# EAGLE board ad060 (EAGLE 5.11), part 1 of 2
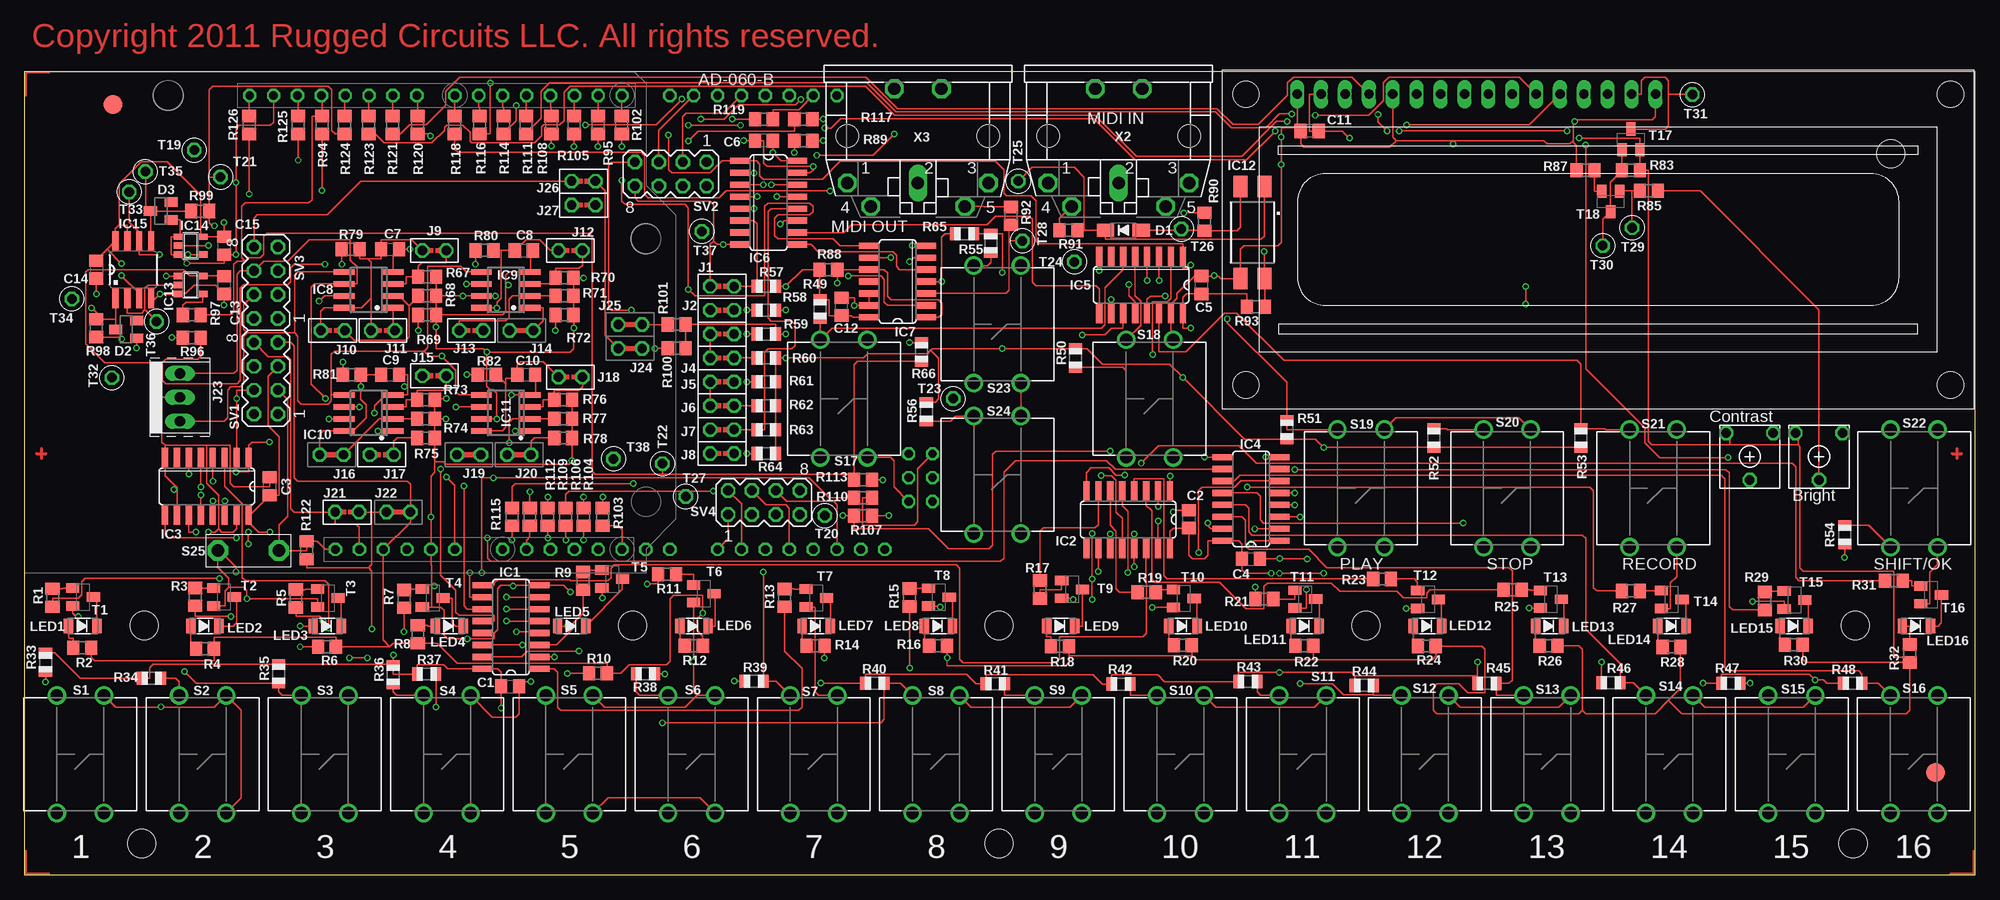
[diagram p9: board, top side]
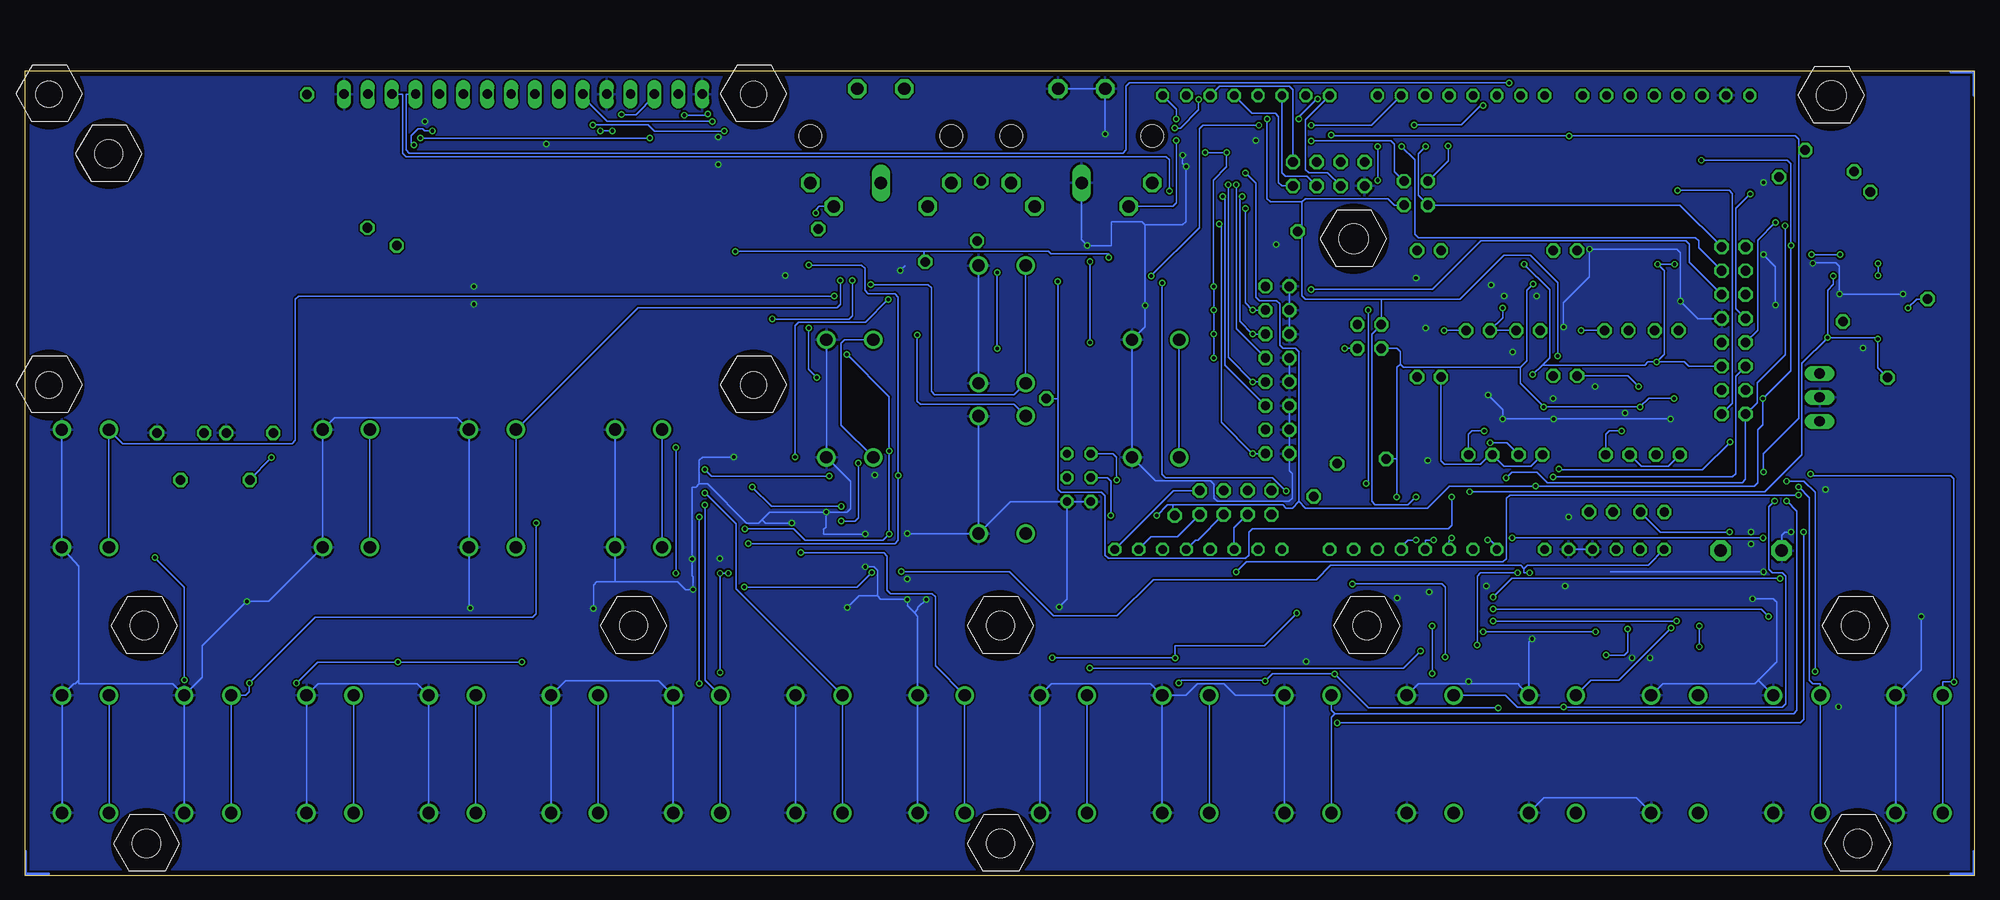
[diagram p10: board, bottom side, seen from below]

Size 207.39 x 85.47 mm. Coordinates in mm from the lower left corner, seen from the top.
Outline: 0,85.47 207.39,85.47 207.39,0 0,0 0,85.47
Copper layers (1*16): Top 0.137mm / dielectric 1.313mm / Bottom 0.137mm
Design rules "wusik *": minimum track width 7mil, minimum drill 15mil, track to track 7mil, track to pad 7mil, pad to pad 7mil, via to via 7mil, smd to smd 0mil, copper to edge 20mil, drill to drill 8mil, minimum pad ring 10mil, minimum via ring 6mil, stop-mask expansion 2mil, vias tented up to drill 0mil, thermal gap 10mil
Net classes: 0 default: width 0.178 mm, drill 0.381 mm, clearance 0.178 mm
Holes 3.17 mm at 15.27,82.91 66.07,67.67
bKeepout: area 62.8,56.7 to 67,63.4
tRestrict: area 43.1,66.2 to 44.1,66.7; area 58.9,73.5 to 59.9,74; area 58.9,71 to 60.1,71.5; area 57.5,66.2 to 58.5,66.7; area 46.9,57.7 to 48.1,58; area 32.1,57.7 to 33.4,58.2; area 37.6,57.8 to 38.6,58; area 43.1,52.8 to 44.2,53.3; area 37.5,44.5 to 38.6,45; area 32,44.6 to 33.1,45; area 52.2,57.8 to 53.3,58.2; area 57.5,52.7 to 58.7,53.1; 13 more areas

## Footprints (pad centres in the part's own frame; a part is rotated, then mirrored left to right if it is on the bottom)
C0805 = smd 1.3 x 1.5: 1 -0.95,0; 2 0.95,0
SOD-123 = smd 1.83 x 1.4: A 1.9,0; K -1.9,0
SOT-23 = smd 1 x 1.4: 1 -0.95,-1.1; 2 0.95,-1.1; 3 0,1.1
FIDUCIAL_2MMCIRCLE = smd 2 x 2: P$1 0,0
SO16 = smd 0.66 x 2.032: 1 -4.445,-3.073; 2 -3.175,-3.073; 3 -1.905,-3.073; 4 -0.635,-3.073; 5 0.635,-3.073; 6 1.905,-3.073; 7 3.175,-3.073; 8 4.445,-3.073; 9 4.445,3.073; 10 3.175,3.073; 11 1.905,3.073; 12 0.635,3.073; 13 -0.635,3.073; 14 -1.905,3.073; 15 -3.175,3.073; 16 -4.445,3.073
SO14 = smd 0.66 x 2.032: 1 -3.81,-3.073; 2 -2.54,-3.073; 3 -1.27,-3.073; 4 0,-3.073; 5 1.27,-3.073; 6 2.54,-3.073; 7 3.81,-3.073; 8 3.81,3.073; 9 2.54,3.073; 10 1.27,3.073; 11 0,3.073; 12 -1.27,3.073; 13 -2.54,3.073; 14 -3.81,3.073
SO-08 = smd 0.6 x 2.2: 1 -1.905,-2.6; 2 -0.635,-2.6; 3 0.635,-2.6; 4 1.905,-2.6; 5 1.905,2.6; 6 0.635,2.6; 7 -0.635,2.6; 8 -1.905,2.6
LITEON.SMD4 = smd 2.3 x 1.5: 1 -4.9,1.27; 2 -4.9,-1.27; 3 4.9,-1.27; 4 4.9,1.27
SOT23-5 = smd 0.69 x 0.99: 1 -0.95,-1.29; 2 0,-1.29; 3 0.95,-1.29; 4 0.95,1.3; 5 -0.95,1.3
SO08 = smd 0.66 x 2.032: 1 -1.905,-3.073; 2 -0.635,-3.073; 3 0.635,-3.073; 4 1.905,-3.073; 5 1.905,3.073; 6 0.635,3.073; 7 -0.635,3.073; 8 -1.905,3.073
JP2NO = drill 1 octagon: 1 -1.27,0; 2 1.27,0
JP2NC = drill 1 octagon: 1 -1.27,0; 2 1.27,0
GC22232031 = drill 1.067 long: 1 0,0; 2 2.54,0; 3 5.08,0
LED1206 = smd 1 x 1.5: A -1.5,0; K 1.5,0
SHIELD-NOTEXT-OCTAGONALPAD = drill 0.9 pad 1.27 octagon: 0_RX -25.4,27.94; 1_TX -25.4,25.4; 2 -25.4,22.86; 3 -25.4,20.32; 3V3 22.86,0; 4 -25.4,17.78; 5 -25.4,15.24; 5V 22.86,2.54; 6 -25.4,12.7; 7 -25.4,10.16; 8 -25.4,6.121; 9 -25.4,3.581; 10 -25.4,1.041; 11 -25.4,-1.499; 12 -25.4,-4.039; 13 -25.4,-6.579; A_0 22.86,15.24; A_1 22.86,17.78; A_2 22.86,20.32; A_3 22.86,22.86; A_4 22.86,25.4; A_5 22.86,27.94; AREF -25.4,-11.659; GND0 -25.4,-9.119; GND1 22.86,7.62; GND2 22.86,5.08; RESET 22.86,-2.54; VIN 22.86,10.16
MEGA-EXTRAPINS-SPIONLY = drill 0.9 octagon: 14 5.08,0; 15 7.62,0; 16 10.16,0; 17 12.7,0; 18 15.24,0; 19 17.78,0; 20 20.32,0; 21 22.86,0; 50 30.48,-38.1; 51 33.02,-38.1; 52 30.48,-40.64; 53 33.02,-40.64; A6 2.54,-48.26; A7 5.08,-48.26; A8 10.16,-48.26; A9 12.7,-48.26; A10 15.24,-48.26; A11 17.78,-48.26; A12 20.32,-48.26; A13 22.86,-48.26; A14 25.4,-48.26; A15 27.94,-48.26; GND@1 30.48,-43.18; GND@2 33.02,-43.18
R0805 = smd 1.3 x 1.5: 1 -0.95,0; 2 0.95,0
R0805' = smd 1.1 x 1.4: 1 -1,0; 2 1,0
EVND8A = drill 1 octagon: 1 -2.5,-2.5; 2 0,2.5; 3 2.5,-2.5
TL1100F160Q = drill 1.3 round: 1 -6.25,-2.5; 2 6.25,-2.5; 3 -6.25,2.5; 4 6.25,2.5
EVQPJ = drill 1.3 pad 2.184 octagon: A 0,0; B 6.5,0
MA04-2 = drill 1.016 octagon: 1 -3.81,-1.27; 2 -3.81,1.27; 3 -1.27,-1.27; 4 -1.27,1.27; 5 1.27,-1.27; 6 1.27,1.27; 7 3.81,-1.27; 8 3.81,1.27
SOT23-BEC = smd 1 x 1.4: B -0.95,-1.1; C 0,1.1; E 0.95,-1.1
TP40MIL = drill 1.016 octagon: 1 0,0
4-40SCREWHEXNUT = hole 2.997: 0,0
LCD1602 = drill 1 long: 1 8,33.46; 2 10.54,33.46; 3 13.08,33.46; 4 15.62,33.46; 5 18.16,33.46; 6 20.7,33.46; 7 23.24,33.46; 8 25.78,33.46; 9 28.32,33.46; 10 30.86,33.46; 11 33.4,33.46; 12 35.94,33.46; 13 38.48,33.46; 14 41.02,33.46; 15 43.56,33.46; 16 46.1,33.46 | hole 2.8: 2.54,2.54; 2.54,33.46; 77.46,33.46; 77.46,2.54
SDS-50J = drill 1.321 octagon: 1 7.5,5; 3 -7.5,5; 4 5,7.5; 5 -5,7.5; PE -2.5,-5; PE@ 2.5,-5 | drill 1.321 long: 2 0,5 | hole 2.4: 7.5,0; -7.5,0

## Placement (x,y rotation side)
C1  0.1uF  [C0805]  51.62,20.08 0 top
C2  0.1uF  [C0805]  123.83,37.86 90 top
C3  0.1uF  [C0805]  26.06,41.36 90 top
C4  0.1uF  [C0805]  130.41,33.63 0 top
C5  0.1uF  [C0805]  125.16,62.75 90 top
C6  0.1uF  [C0805]  78.61,78.11 180 top
C7  0.1uF  [C0805]  38.86,66.55 0 top
C8  0.1uF  [C0805]  53.09,66.42 0 top
C9  0.1uF  [C0805]  38.86,53.21 0 top
C10  0.1uF  [C0805]  53.34,53.21 0 top
C11  0.1uF  [C0805]  136.65,79.12 180 top
C12  0.1uF  [C0805]  86.87,60.45 90 top
C13  0.1uF  [C0805]  21.21,62.74 270 top
C14  0.1uF  [C0805]  7.62,64.39 270 top
C15  0.1uF  [C0805]  21.21,66.93 270 top
D1  [SOD-123]  116.84,68.58 0 top
D2  3.3V  [SOT-23]  10.79,58.04 90 top
D3  3.3V  [SOT-23]  14.48,70.61 90 top
FM1  FIDUCIAL2MMCIRCLE  [FIDUCIAL_2MMCIRCLE]  203.2,10.92 0 top
FM2  FIDUCIAL2MMCIRCLE  [FIDUCIAL_2MMCIRCLE]  9.4,81.92 0 top
FM3  [CROSSHAIR_12MIL]  1.78,44.83 0 top
FM4  [CROSSHAIR_12MIL]  205.49,44.83 0 top
IC1  74HC595D  [SO16]  51.71,26.38 90 top
IC2  74HC595D  [SO16]  117.36,37.81 180 top
IC3  74HC165D  [SO16]  19.37,41.34 180 top
IC4  74HC165D  [SO16]  130.43,40.01 90 top
IC5  74HC165D  [SO16]  118.73,62.75 180 top
IC6  74HC165D  [SO16]  79.1,71.5 270 top
IC7  74HC125D  [SO14]  92.84,63.12 90 top
IC8  M24256-BWMN6P  [SO-08]  36.58,62.23 90 top
IC9  M24256-BWMN6P  [SO-08]  51.18,62.23 90 top
IC10  M24256-BWMN6P  [SO-08]  36.58,49.15 90 top
IC11  M24256-BWMN6P  [SO-08]  51.18,49.15 90 top
IC12  LTV-817S  [LITEON.SMD4]  130.56,68.33 270 top
IC13  74VHC1GT125D  [SOT23-5]  17.65,62.74 270 top
IC14  74VHC1GT125D  [SOT23-5]  17.65,66.93 270 top
IC15  SST25VF040B  [SO08]  11.56,64.39 0 top
J1  JP2NO  [JP2NO]  74.17,62.61 0 top
J2  JP2NO  [JP2NO]  74.17,60.07 0 top
J3  JP2NO  [JP2NO]  74.17,57.53 0 top
J4  JP2NO  [JP2NO]  74.17,54.99 0 top
J5  JP2NO  [JP2NO]  74.17,52.45 0 top
J6  JP2NO  [JP2NO]  74.17,49.91 0 top
J7  JP2NO  [JP2NO]  74.17,47.37 0 top
J8  JP2NO  [JP2NO]  74.17,44.83 0 top
J9  JP2NO  [JP2NO]  43.56,66.42 180 top
J10  JP2NO  [JP2NO]  32.77,57.91 180 top
J11  JP2NO  [JP2NO]  38.1,57.91 180 top
J12  JP2NO  [JP2NO]  58.04,66.42 180 top
J13  JP2NO  [JP2NO]  47.5,57.91 0 top
J14  JP2NC  [JP2NC]  52.83,57.91 180 top
J15  JP2NO  [JP2NO]  43.56,53.09 180 top
J16  JP2NC  [JP2NC]  32.64,44.7 180 top
J17  JP2NO  [JP2NO]  37.97,44.7 180 top
J18  JP2NO  [JP2NO]  58.04,52.96 180 top
J19  JP2NC  [JP2NC]  47.24,44.7 180 top
J20  JP2NC  [JP2NC]  52.58,44.7 180 top
J21  JP2NO  [JP2NO]  34.29,38.61 0 top
J22  JP2NC  [JP2NC]  39.75,38.61 0 top
J23  CON3P1R.GC22232031  [GC22232031]  16.51,48.26 90 top
J24  JP2NC  [JP2NC]  64.39,56.01 0 top
J25  JP2NC  [JP2NC]  64.39,58.55 0 top
J26  JP2NO  [JP2NO]  59.44,73.79 0 top
J27  JP2NO  [JP2NO]  59.44,71.25 0 top
LED1  Red  [LED1206]  6.17,26.49 0 top
LED2  Red  [LED1206]  19.17,26.49 0 top
LED3  Red  [LED1206]  32.17,26.49 0 top
LED4  Red  [LED1206]  45.17,26.49 0 top
LED5  Red  [LED1206]  58.17,26.49 0 top
LED6  Red  [LED1206]  71.17,26.49 0 top
LED7  Red  [LED1206]  84.17,26.49 0 top
LED8  Red  [LED1206]  97.17,26.49 0 top
LED9  Red  [LED1206]  110.17,26.49 0 top
LED10  Red  [LED1206]  123.17,26.49 0 top
LED11  Red  [LED1206]  136.17,26.49 0 top
LED12  Red  [LED1206]  149.17,26.49 0 top
LED13  Red  [LED1206]  162.17,26.49 0 top
LED14  Red  [LED1206]  175.17,26.49 0 top
LED15  Red  [LED1206]  188.17,26.49 0 top
LED16  Red  [LED1206]  201.17,26.49 0 top
M1  Arduino UNO  [SHIELD-NOTEXT-OCTAGONALPAD]  35.59,57.51 270 top
M2  [MEGA-EXTRAPINS-SPIONLY]  63.53,82.91 0 top
R1  10k  [R0805]  2.96,29.49 270 top
R2  300  [R0805]  6.12,24.18 0 top
R3  10k  [R0805]  18.15,29.59 270 top
R4  300  [R0805]  19.19,24.09 0 top
R5  10k  [R0805]  28.85,29.42 270 top
R6  300  [R0805]  32.16,24.29 0 top
R7  10k  [R0805]  40.34,29.38 270 top
R8  300  [R0805]  41.81,25.62 270 top
R9  10k  [R0805]  59.39,31.29 270 top
R10  300  [R0805]  60.96,21.46 0 top
R11  10k  [R0805]  68.31,31.99 180 top
R12  300  [R0805]  71.16,24.4 0 top
R13  10k  [R0805]  80.81,29.48 270 top
R14  300  [R0805]  84.1,24.37 0 top
R15  10k  [R0805]  94.12,29.53 270 top
R16  300  [R0805]  97.14,24.4 0 top
R17  10k  [R0805]  107.97,30.38 90 top
R18  300  [R0805]  110.1,24.36 0 top
R19  10k  [R0805]  119.33,30.09 180 top
R20  300  [R0805]  123.16,24.44 0 top
R21  10k  [R0805]  131.83,29.36 180 top
R22  300  [R0805]  136.09,24.41 0 top
R23  10k  [R0805]  144.35,31.49 180 top
R24  300  [R0805]  149.11,24.36 0 top
R25  10k  [R0805]  158.24,30.34 180 top
R26  300  [R0805]  162.05,24.39 0 top
R27  10k  [R0805]  170.81,30.22 180 top
R28  300  [R0805]  175.14,24.26 0 top
R29  10k  [R0805]  185.04,29.15 270 top
R30  300  [R0805]  188.13,24.49 0 top
R31  10k  [R0805]  198.79,31.31 180 top
R32  300  [R0805]  200.47,23.57 270 top
R33  10k  [R0805']  2.22,22.62 90 top
R34  10k  [R0805']  13.49,20.92 180 top
R35  10k  [R0805']  27,21.42 90 top
R36  10k  [R0805']  39.2,21.32 90 top
R37  10k  [R0805']  42.74,21.39 180 top
R38  10k  [R0805']  66.02,21.4 0 top
R39  10k  [R0805']  77.56,20.64 180 top
R40  10k  [R0805']  90.41,20.42 180 top
R41  10k  [R0805']  103.22,20.36 180 top
R42  10k  [R0805']  116.58,20.32 180 top
R43  10k  [R0805']  130.09,20.59 180 top
R44  10k  [R0805']  142.46,20.17 180 top
R45  10k  [R0805']  155.5,20.39 180 top
R46  10k  [R0805']  168.69,20.47 180 top
R47  10k  [R0805']  181.44,20.41 180 top
R48  10k  [R0805']  194.39,20.41 180 top
R49  10k  [R0805']  84.58,60.2 90 top
R50  10k  [R0805']  111.76,54.99 90 top
R51  10k  [R0805']  134.24,47.37 270 top
R52  10k  [R0805']  149.86,46.48 270 top
R53  10k  [R0805']  165.48,46.48 270 top
R54  10k  [R0805']  193.55,36.2 270 top
R55  10k  [R0805']  102.74,67.18 90 top
R56  10k  [R0805']  95.89,49.28 90 top
R57  10k  [R0805']  78.87,62.61 0 top
R58  10k  [R0805']  78.87,60.07 0 top
R59  10k  [R0805']  78.87,57.53 0 top
R60  10k  [R0805']  78.87,54.99 0 top
R61  10k  [R0805']  78.87,52.45 0 top
R62  10k  [R0805']  78.87,49.91 0 top
R63  10k  [R0805']  78.87,47.37 0 top
R64  10k  [R0805']  78.87,44.83 0 top
R65  10k  [R0805']  99.95,68.2 0 top
R66  1k  [R0805']  95.38,55.63 90 top
R67  10k  [R0805]  42.8,63.63 180 top
R68  10k  [R0805]  42.8,61.59 180 top
R69  10k  [R0805]  42.8,59.56 180 top
R70  10k  [R0805]  57.4,63.5 180 top
R71  10k  [R0805]  57.4,61.59 180 top
R72  10k  [R0805]  57.4,59.56 180 top
R73  10k  [R0805]  42.67,50.55 180 top
R74  10k  [R0805]  42.67,48.51 180 top
R75  10k  [R0805]  42.67,46.48 180 top
R76  10k  [R0805]  57.28,50.55 180 top
R77  10k  [R0805]  57.28,48.51 180 top
R78  10k  [R0805]  57.28,46.48 180 top
R79  10  [R0805]  34.67,66.55 0 top
R80  10  [R0805]  48.9,66.42 0 top
R81  10  [R0805]  34.8,53.21 0 top
R82  10  [R0805]  49.15,53.21 0 top
R83  10k  [R0805]  170.81,74.93 0 top
R84  10k  [EVND8A]  183.45,44.51 180 top
R85  10k  [R0805]  172.72,72.77 180 top
R86  10k  [EVND8A]  190.82,44.51 180 top
R87  4.7k  [R0805]  165.99,74.93 0 top
R88  10k  [R0805]  85.47,64.39 180 top
R89  120  [R0805]  82.8,78.11 180 top
R90  120  [R0805]  125.48,69.47 90 top
R91  120  [R0805]  111,68.58 0 top
R92  120  [R0805]  104.9,70.1 90 top
R93  300  [R0805]  130.94,60.45 180 top
R94  1k  [R0805]  31.62,79.76 90 top
R95  1k  [R0805]  60.96,79.76 90 top
R96  10k  [R0805]  17.78,57.15 0 top
R97  1k  [R0805]  17.78,59.56 180 top
R98  1k  [R0805]  7.62,58.17 90 top
R99  1k  [R0805]  18.67,70.61 180 top
R100  1.5k  [R0805]  69.34,56.01 0 top
R101  1.5k  [R0805]  69.34,58.55 0 top
R102  100  [R0805]  63.5,79.76 90 top
R103  100  [R0805]  61.47,38.1 90 top
R104  100  [R0805]  59.44,38.1 90 top
R105  100  [R0805]  58.42,79.76 90 top
R106  100  [R0805]  57.53,38.1 90 top
R107  100  [R0805]  89.15,38.23 0 top
R108  100  [R0805]  56.01,79.76 90 top
R109  100  [R0805]  55.63,38.1 90 top
R110  100  [R0805]  89.15,40.13 0 top
R111  100  [R0805]  53.34,79.76 90 top
R112  100  [R0805]  53.72,38.1 90 top
R113  100  [R0805]  89.15,42.04 0 top
R114  100  [R0805]  50.93,79.76 90 top
R115  100  [R0805]  51.82,38.1 90 top
R116  100  [R0805]  48.39,79.76 90 top
R117  100  [R0805]  82.8,80.39 0 top
R118  100  [R0805]  45.72,79.76 90 top
R119  100  [R0805]  78.61,80.39 0 top
R120  100  [R0805]  41.78,79.76 90 top
R121  100  [R0805]  39.12,79.76 90 top
R122  10k  [R0805]  29.97,34.54 270 top
R123  100  [R0805]  36.58,79.76 90 top
R124  100  [R0805]  34.04,79.76 90 top
R125  100  [R0805]  29.08,79.76 90 top
R126  100  [R0805]  23.88,79.76 90 top
S1  [TL1100F160Q]  5.92,12.87 90 top
S2  [TL1100F160Q]  18.92,12.87 90 top
S3  [TL1100F160Q]  31.92,12.87 90 top
S4  [TL1100F160Q]  44.92,12.87 90 top
S5  [TL1100F160Q]  57.92,12.87 90 top
S6  [TL1100F160Q]  70.92,12.87 90 top
S7  [TL1100F160Q]  83.92,12.87 90 top
S8  [TL1100F160Q]  96.92,12.87 90 top
S9  [TL1100F160Q]  109.92,12.87 90 top
S10  [TL1100F160Q]  122.92,12.87 90 top
S11  [TL1100F160Q]  135.92,12.87 90 top
S12  [TL1100F160Q]  148.92,12.87 90 top
S13  [TL1100F160Q]  161.92,12.87 90 top
S14  [TL1100F160Q]  174.92,12.87 90 top
S15  [TL1100F160Q]  187.92,12.87 90 top
S16  [TL1100F160Q]  200.92,12.87 90 top
S17  [TL1100F160Q]  87.12,50.67 90 top
S18  [TL1100F160Q]  119.63,50.67 90 top
S19  [TL1100F160Q]  142.11,41.12 90 top
S20  [TL1100F160Q]  157.65,41.12 90 top
S21  [TL1100F160Q]  173.19,41.12 90 top
S22  [TL1100F160Q]  200.94,41.12 90 top
S23  [TL1100F160Q]  103.44,58.57 90 top
S24  [TL1100F160Q]  103.44,42.57 90 top
S25  [EVQPJ]  20.55,34.51 0 top
SV1  [MA04-2]  25.65,52.83 90 top
SV2  [MA04-2]  68.71,74.55 180 top
SV3  [MA04-2]  25.65,62.99 90 top
SV4  [MA04-2]  78.61,39.62 0 top
T1  NPN  [SOT23-BEC]  6.21,29.56 270 top
T2  NPN  [SOT23-BEC]  21.2,29.58 270 top
T3  NPN  [SOT23-BEC]  32.25,29.46 270 top
T4  NPN  [SOT23-BEC]  43.4,29.46 270 top
T5  NPN  [SOT23-BEC]  62.48,31.48 270 top
T6  NPN  [SOT23-BEC]  72.23,29.92 270 top
T7  NPN  [SOT23-BEC]  84.18,29.46 270 top
T8  NPN  [SOT23-BEC]  97.23,29.55 270 top
T9  NPN  [SOT23-BEC]  111.39,30.39 270 top
T10  NPN  [SOT23-BEC]  123.28,29.42 270 top
T11  NPN  [SOT23-BEC]  136.19,29.35 270 top
T12  NPN  [SOT23-BEC]  149.24,29.32 270 top
T13  NPN  [SOT23-BEC]  162.31,29.34 270 top
T14  NPN  [SOT23-BEC]  175.16,29.3 270 top
T15  NPN  [SOT23-BEC]  188.21,29.25 270 top
T16  NPN  [SOT23-BEC]  202.75,29.8 270 top
T17  PNP  [SOT23-BEC]  170.81,78.23 0 top
T18  NPN  [SOT23-BEC]  168.66,71.63 180 top
T19  [TP40MIL]  18.03,77.09 0 top
T20  [TP40MIL]  85.09,38.23 0 top
T21  [TP40MIL]  20.83,74.23 0 top
T22  [TP40MIL]  67.82,43.75 270 top
T23  [TP40MIL]  98.74,50.67 270 top
T24  [TP40MIL]  111.63,65.21 270 top
T25  [TP40MIL]  105.66,73.79 270 top
T26  [TP40MIL]  123,68.71 270 top
T27  [TP40MIL]  70.29,40.26 270 top
T28  [TP40MIL]  106.11,67.44 270 top
T29  [TP40MIL]  170.94,68.83 270 top
T30  [TP40MIL]  167.83,66.93 270 top
T31  [TP40MIL]  177.36,82.99 270 top
T32  [TP40MIL]  9.27,52.9 270 top
T33  [TP40MIL]  11.11,72.64 270 top
T34  [TP40MIL]  5.02,61.28 270 top
T35  [TP40MIL]  12.83,74.8 270 top
T36  [TP40MIL]  14.03,58.86 270 top
T37  [TP40MIL]  72.01,68.45 270 top
T38  [TP40MIL]  62.61,44.26 270 top
U$1  [CORNER-BL-NOARROW]  0,85.47 270 top
U$2  [4-40SCREWHEXNUT]  198.44,76.71 0 top
U$3  [CORNER-BL-NOARROW]  0,0 0 top
U$4  [CORNER-BL-NOARROW]  207.39,0 90 top
U$5  [PB-MARK-0.2]  64.5,35.46 0 top
U$6  [4-40SCREWHEXNUT]  103.63,3.37 0 top
U$7  [4-40SCREWHEXNUT]  12.7,26.54 0 top
U$8  [4-40SCREWHEXNUT]  64.64,26.54 0 top
U$9  [ROHS-MARK-0.2]  184.99,36.06 0 top
U$10  [4-40SCREWHEXNUT]  103.63,26.54 0 top
U$11  [4-40SCREWHEXNUT]  194.69,26.54 0 top
U$12  [4-40SCREWHEXNUT]  142.62,26.54 0 top
U$13  [4-40SCREWHEXNUT']  15.27,82.91 0 top
U$14  [4-40SCREWHEXNUT']  66.07,67.67 0 top
U$15  [4-40SCREWHEXNUT']  129.86,83.06 0 top
U$16  [4-40SCREWHEXNUT']  129.86,52.13 0 top
U$17  [4-40SCREWHEXNUT']  204.79,52.13 0 top
U$18  [4-40SCREWHEXNUT']  204.79,83.06 0 top
U$19  [4-40SCREWHEXNUT]  12.45,3.37 0 top
U$20  [4-40SCREWHEXNUT]  194.44,3.37 0 top
X1  16x2  [LCD1602]  127.34,49.58 0 top
X2  SDS-50J  [SDS-50J]  116.33,78.61 180 top
X3  SDS-50J  [SDS-50J]  95,78.61 180 top